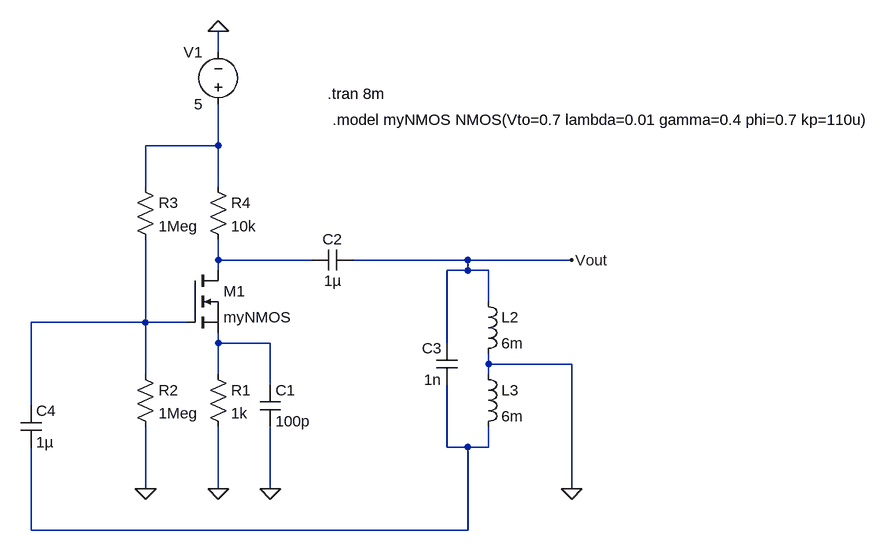
[diagram p0: schematic Hertley.asc]
Hertley.asc, the LTspice schematic file:
Version 4
SHEET 1 1424 724
WIRE 416 -16 416 -48
WIRE 416 128 416 64
WIRE 416 128 304 128
WIRE 304 192 304 128
WIRE 416 192 416 128
WIRE 416 304 416 272
WIRE 560 304 416 304
WIRE 800 304 624 304
WIRE 960 304 800 304
WIRE 416 320 416 304
WIRE 800 320 800 304
WIRE 800 320 768 320
WIRE 832 320 800 320
WIRE 832 368 832 320
WIRE 304 400 304 272
WIRE 304 400 128 400
WIRE 368 400 304 400
WIRE 416 432 416 416
WIRE 496 432 416 432
WIRE 768 432 768 320
WIRE 832 464 832 448
WIRE 960 464 832 464
WIRE 304 480 304 400
WIRE 416 480 416 432
WIRE 832 480 832 464
WIRE 496 496 496 432
WIRE 128 528 128 400
WIRE 768 592 768 496
WIRE 800 592 768 592
WIRE 832 592 832 560
WIRE 832 592 800 592
WIRE 304 656 304 560
WIRE 416 656 416 560
WIRE 496 656 496 560
WIRE 960 656 960 464
WIRE 128 720 128 592
WIRE 800 720 800 592
WIRE 800 720 128 720
FLAG 304 656 0
FLAG 416 656 0
FLAG 416 -48 0
FLAG 960 656 0
FLAG 960 304 Vout
FLAG 496 656 0
SYMBOL Res 400 464 R0
SYMATTR InstName R1
SYMATTR Value 1k
SYMBOL Res 288 464 R0
SYMATTR InstName R2
SYMATTR Value 1Meg
SYMBOL Res 288 176 R0
SYMATTR InstName R3
SYMATTR Value 1Meg
SYMBOL cap 480 496 R0
SYMATTR InstName C1
SYMATTR Value 100p
SYMBOL cap 624 288 R90
WINDOW 0 0 32 VBottom 2
WINDOW 3 32 32 VTop 2
SYMATTR InstName C2
SYMATTR Value 1µ
SYMBOL cap 784 496 R180
WINDOW 0 24 56 Left 2
WINDOW 3 24 8 Left 2
SYMATTR InstName C3
SYMATTR Value 1n
SYMBOL ind 816 352 R0
SYMATTR InstName L2
SYMATTR Value 6m
SYMBOL ind 816 464 R0
SYMATTR InstName L3
SYMATTR Value 6m
SYMBOL Voltage 416 80 R180
WINDOW 0 24 96 Left 2
WINDOW 3 24 16 Left 2
SYMATTR InstName V1
SYMATTR Value 5
SYMBOL nmos 368 320 R0
SYMATTR InstName M1
SYMATTR Value myNMOS
SYMBOL Res 400 176 R0
SYMATTR InstName R4
SYMATTR Value 10k
SYMBOL cap 112 528 R0
SYMATTR InstName C4
SYMATTR Value 1µ
TEXT 584 48 Left 2 !.tran 8m
TEXT 592 88 Left 2 !.model myNMOS NMOS(Vto=0.7 lambda=0.01 gamma=0.4 phi=0.7 kp=110u)

The netlist it stands for:
* Hertley.asc
R1 N004 0 1k
R2 N003 0 1Meg
R3 N001 N003 1Meg
C1 N004 0 100p
C2 Vout N002 1µ
C3 N005 Vout 1n
L2 Vout 0 6m
L3 0 N005 6m
V1 N001 0 5
M1 N002 N003 N004 N004 myNMOS
R4 N001 N002 10k
C4 N003 N005 1µ
.model NMOS NMOS
.model PMOS PMOS
.lib standard.mos
.tran 8m
.model myNMOS NMOS(Vto=0.7 lambda=0.01 gamma=0.4 phi=0.7 kp=110u)
.backanno
.end